# EAGLE schematic Original Business Card Schematic (EAGLE 8.0.1)
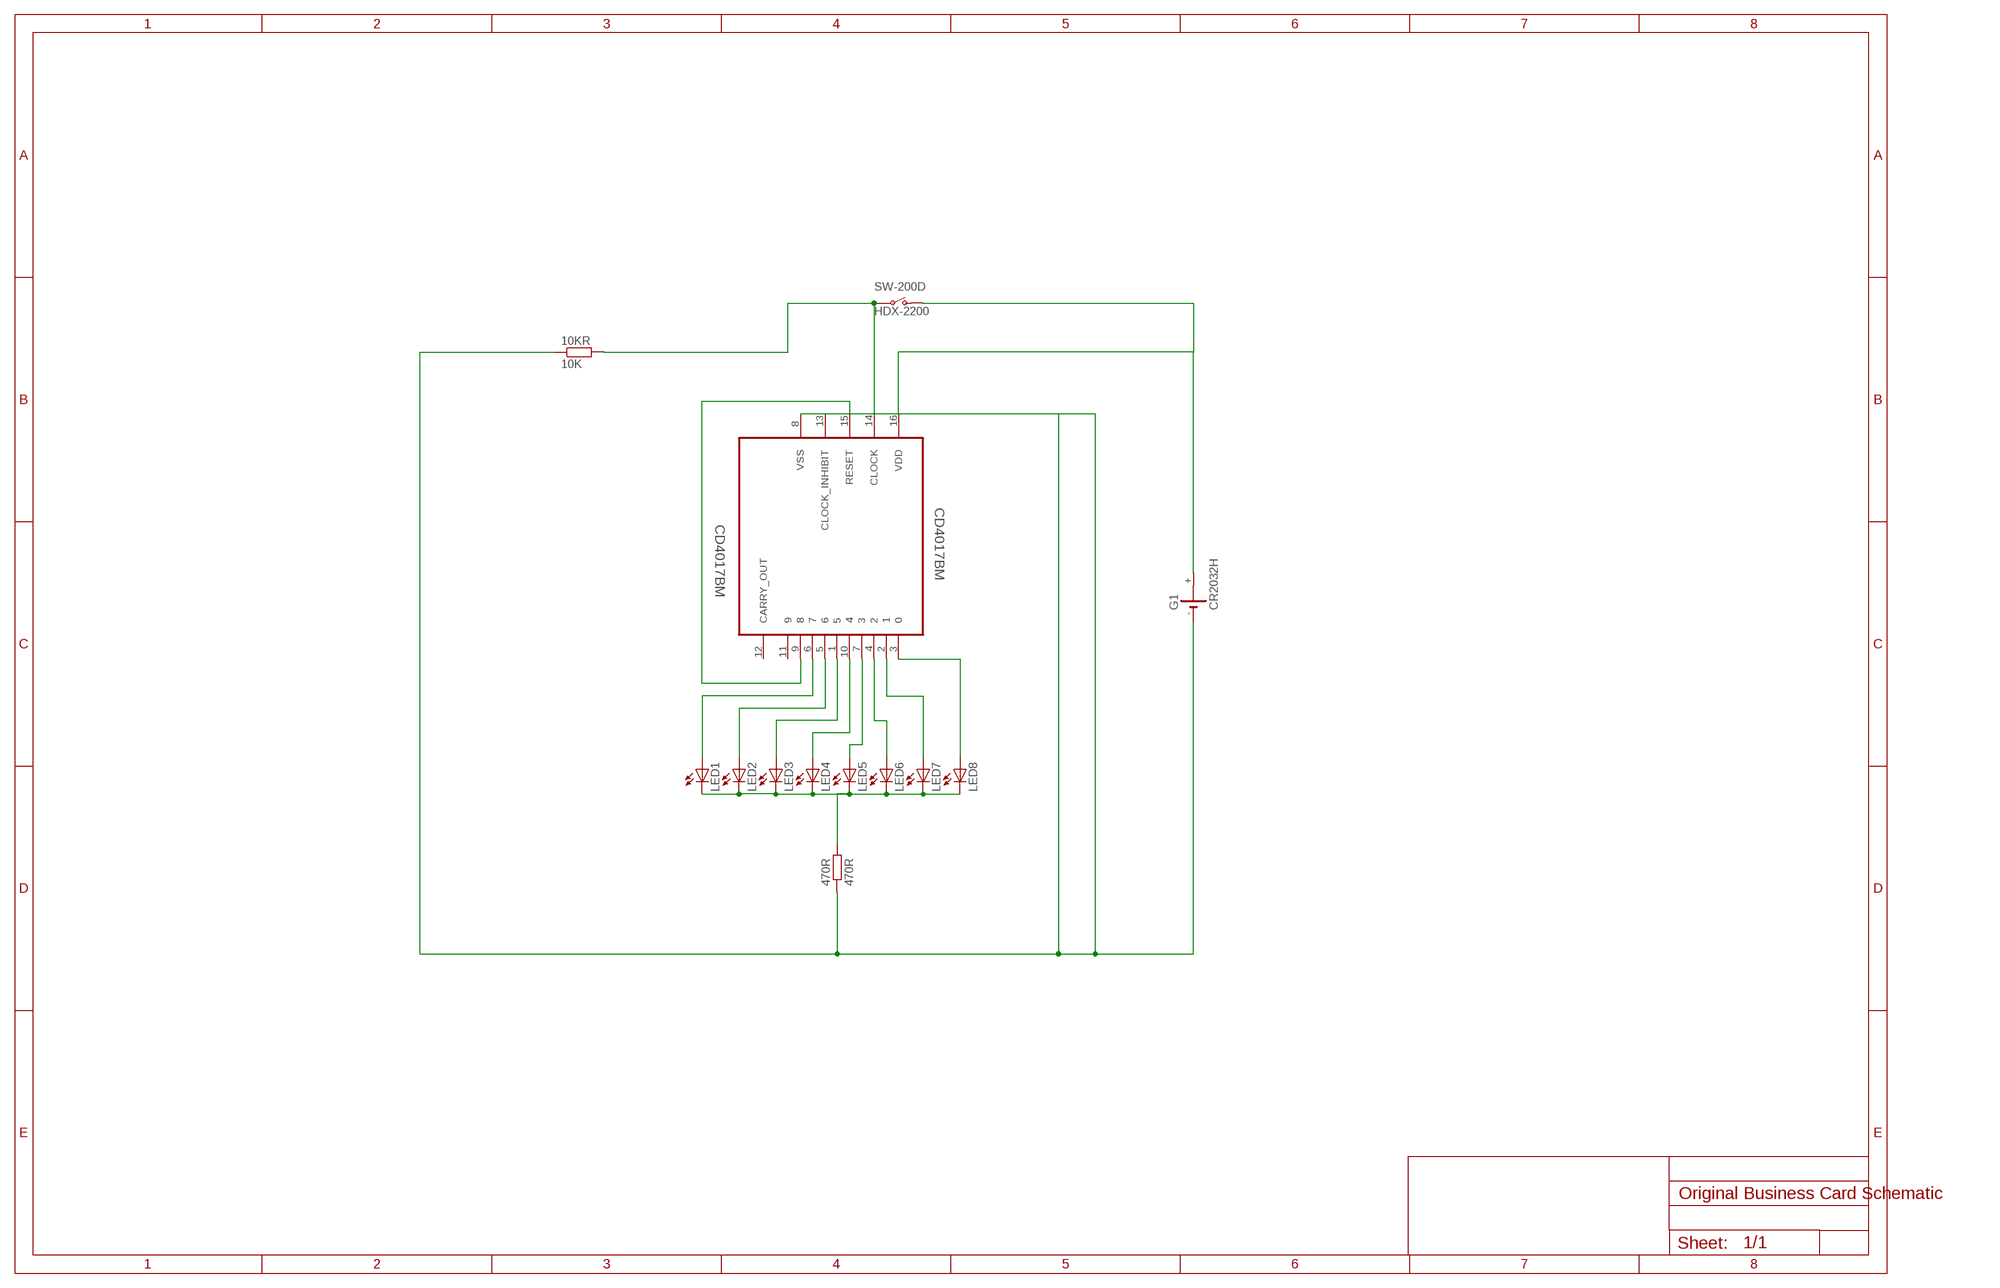
[diagram p0: schematic, sheet 1]

## Parts
10KR  10K  R-EU_R0805  [R0805]
470R  470R  R-EU_R0603  [R0603]
CD4017BM  CD4017BM  [SOIC127P600X175-16N]
G1  CR2032H  [CR2032H]
LED1  LEDCHIPLED_0603  [CHIPLED_0603]
LED2  LEDCHIPLED_0603  [CHIPLED_0603]
LED3  LEDCHIPLED_0603  [CHIPLED_0603]
LED4  LEDCHIPLED_0603  [CHIPLED_0603]
LED5  LEDCHIPLED_0603  [CHIPLED_0603]
LED6  LEDCHIPLED_0603  [CHIPLED_0603]
LED7  LEDCHIPLED_0603  [CHIPLED_0603]
LED8  LEDCHIPLED_0603  [CHIPLED_0603]
SW-200D  HDX-2200  [SWITCH-HORIZONTAL]

## Nets
N$1: 10KR.2 CD4017BM.14(CLOCK) SW-200D.P$2(P)
N$2: CD4017BM.3 LED8.A
N$3: CD4017BM.2 LED7.A
N$4: CD4017BM.4 LED6.A
N$5: CD4017BM.7 LED5.A
N$6: CD4017BM.10 LED4.A
N$7: CD4017BM.1 LED3.A
N$8: CD4017BM.5 LED2.A
N$9: CD4017BM.6 LED1.A
N$10: CD4017BM.9 CD4017BM.15(RESET)
N$11: 470R.2 LED1.C LED2.C LED3.C LED4.C LED5.C LED6.C LED7.C LED8.C
N$12: 10KR.1 470R.1 CD4017BM.8(VSS) CD4017BM.13(CLOCK_INHIBIT) G1.-
N$13: CD4017BM.16(VDD) G1.+ SW-200D.P$1(O)
Unconnected: CD4017BM.11 CD4017BM.12(CARRY_OUT) G1.+@1(+)

## Library data of the parts
10KR 470R = resistor:R-EU_: RESISTOR, European symbol
CD4017BM = Texas Instruments:CD4017BM: CMOS Counters/Dividers; MPN: CD4017BM; OC_FARNELL: 1741256; OC_NEWARK: 50R5014; PACKAGE: SOIC-16; SUPPLIER: Texas Instruments
G1 = battery:CR2032H: LI BATTERY Varta
LED1-LED8 = led:LED: LED OSRAM: - CHIPLED LG R971, LG N971, LY N971, LG Q971, LY Q971, LO R971, LY R971 LH N974, LH R974 LS Q976, LO Q976, LY Q976 LO Q996 - Hyper CHIPLED LW Q18S LB Q993, LB Q99A, LB R99A - SideLED LS A670, LO A670, LY A670, LG A670, LP A670 LB A673, LV A673, LT A673, LW A673 LH A674 LY A675 LS A676, LA A676, LO A676, LY A676, LW A676 LS A679, LY A679, LG A679 - Hyper Micro SIDELED® LS Y876, LA Y876, LO Y876, LY Y876 LT Y87S - SmartLED LW L88C, LW L88S LB L89C, LB L89S, LG L890 LS L89K, LO L89K, LY L89K LS L896, LA L896, LO L896, LY L896 - TOPLED LS T670, LO T670, LY T670, LG T670, LP T670 LSG T670, LSP T670, LSY T670, LOP T670, LYG T670 LG T671, LOG T671, LSG T671 LB T673, LV T673, LT T673, LW T673 LH T674 LS T676, LA T676, LO T676, LY T676, LB T676, LH T676, LSB T676, LW T676 LB T67C, LV T67C, LT T67C, LS T67K, LO T67K, LY T67K, LW E67C LS E67B, LA E67B, LO E67B, LY E67B, LB E67C, LV E67C, LT E67C LW T67C LS T679, LY T679, LG T679 LS T770, LO T770, LY T770, LG T770, LP T770 LB T773, LV T773, LT T773, LW T773 LH T774 LS E675, LA E675, LY E675, LS T675 LS T776, LA T776, LO T776, LY T776, LB T776 LHGB T686 LT T68C, LB T68C - Hyper Mini TOPLED® LB M676 - Mini TOPLED Santana® LG M470 LS M47K, LO M47K, LY M47K Source: http://www.osram.convergy.de LUXEON: - LUMILED® LXK2-PW12-R00, LXK2-PW12-S00, LXK2-PW14-U00, LXK2-PW14-V00 LXK2-PM12-R00, LXK2-PM12-S00, LXK2-PM14-U00 LXK2-PE12-Q00, LXK2-PE12-R00, LXK2-PE12-S00, LXK2-PE14-T00, LXK2-PE14-U00 LXK2-PB12-K00, LXK2-PB12-L00, LXK2-PB12-M00, LXK2-PB14-N00, LXK2-PB14-P00, LXK2-PB14-Q00 LXK2-PR12-L00, LXK2-PR12-M00, LXK2-PR14-Q00, LXK2-PR14-R00 LXK2-PD12-Q00, LXK2-PD12-R00, LXK2-PD12-S00 LXK2-PH12-R00, LXK2-PH12-S00 LXK2-PL12-P00, LXK2-PL12-Q00, LXK2-PL12-R00 Source: www.luxeon.com KINGBRIGHT: KA-3528ASYC Source: www.kingbright.com
SW-200D = lio:HDX: Ball switch